# EAGLE design Camera Cage Breakout (EAGLE 9.6.2)

## Sheet 1 of 2: Connectors
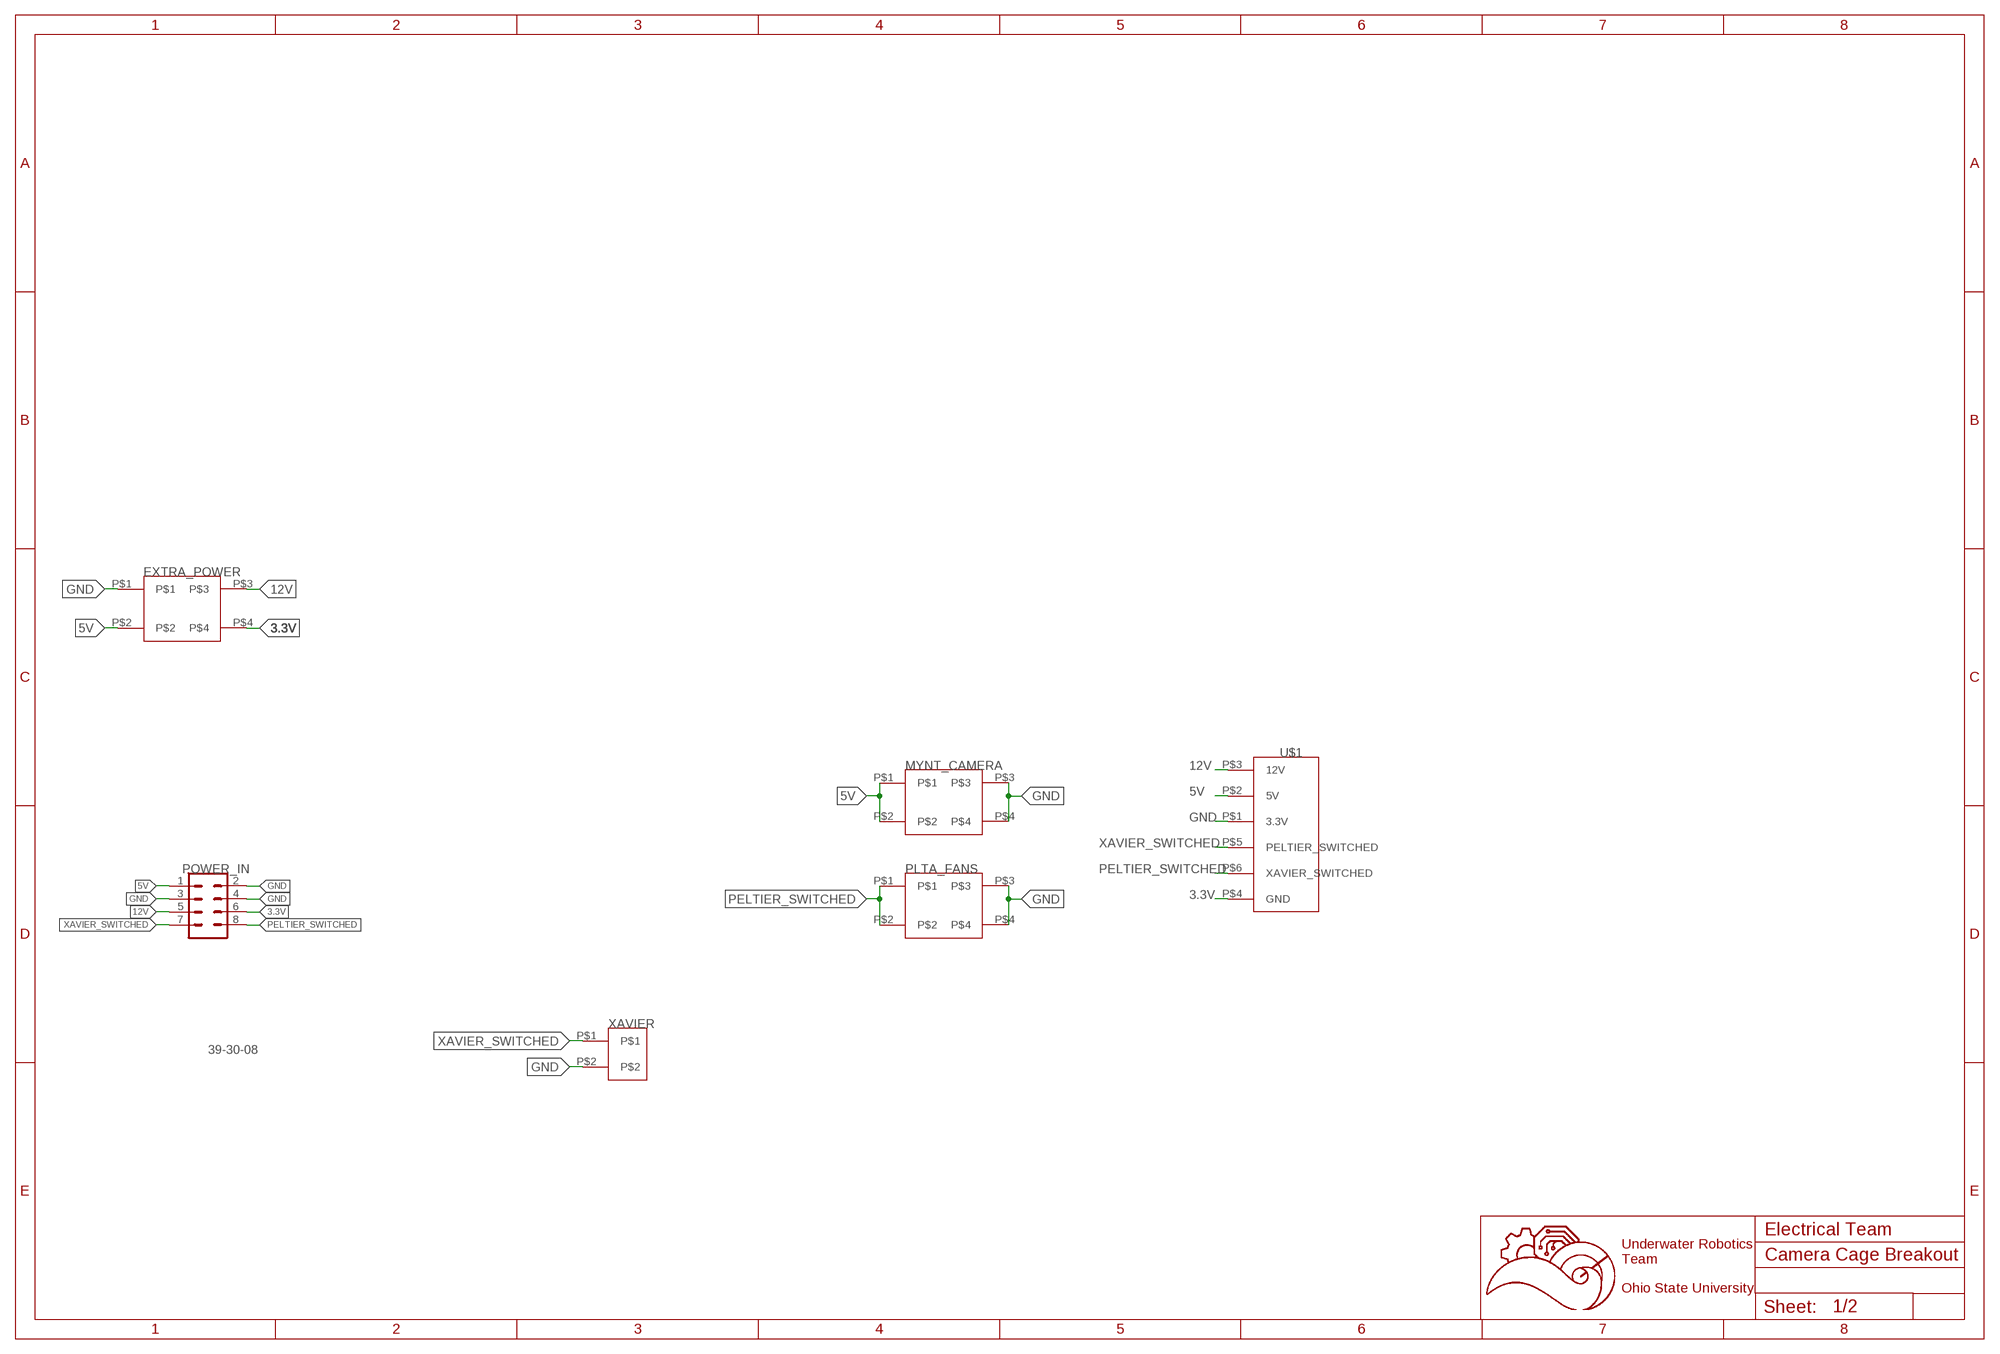
[diagram p0: schematic, sheet 1]

### Parts
EXTRA_POWER  4PIN-VERT  [4PIN-VERT]
MYNT_CAMERA  4PIN-VERT  [4PIN-VERT]
PLTA_FANS  4PIN-VERT  [4PIN-VERT]
POWER_IN  39-30-08  [39-30-?08?]
U$1  CAMERA_CAGE_TEST  [6-PIN]
XAVIER  2PIN-VERT  [2PIN-VERT]

### Nets
3.3V: EXTRA_POWER.P$4 POWER_IN.6 U$1.P$4(GND)
5V: EXTRA_POWER.P$2 MYNT_CAMERA.P$1 MYNT_CAMERA.P$2 POWER_IN.1 U$1.P$2(5V)
12V: EXTRA_POWER.P$3 POWER_IN.5 U$1.P$3(12V)
GND: EXTRA_POWER.P$1 MYNT_CAMERA.P$3 MYNT_CAMERA.P$4 PLTA_FANS.P$3 PLTA_FANS.P$4 POWER_IN.2 POWER_IN.3 POWER_IN.4 U$1.P$1(3.3V) XAVIER.P$2
PELTIER_SWITCHED: PLTA_FANS.P$1 PLTA_FANS.P$2 POWER_IN.8 U$1.P$6(XAVIER_SWITCHED)
XAVIER_SWITCHED: POWER_IN.7 U$1.P$5(PELTIER_SWITCHED) XAVIER.P$1

### Notes on the sheet
- Electrical Team
- Underwater Robotics
  Team
  
  Ohio State University

## Sheet 2 of 2: Led indicator
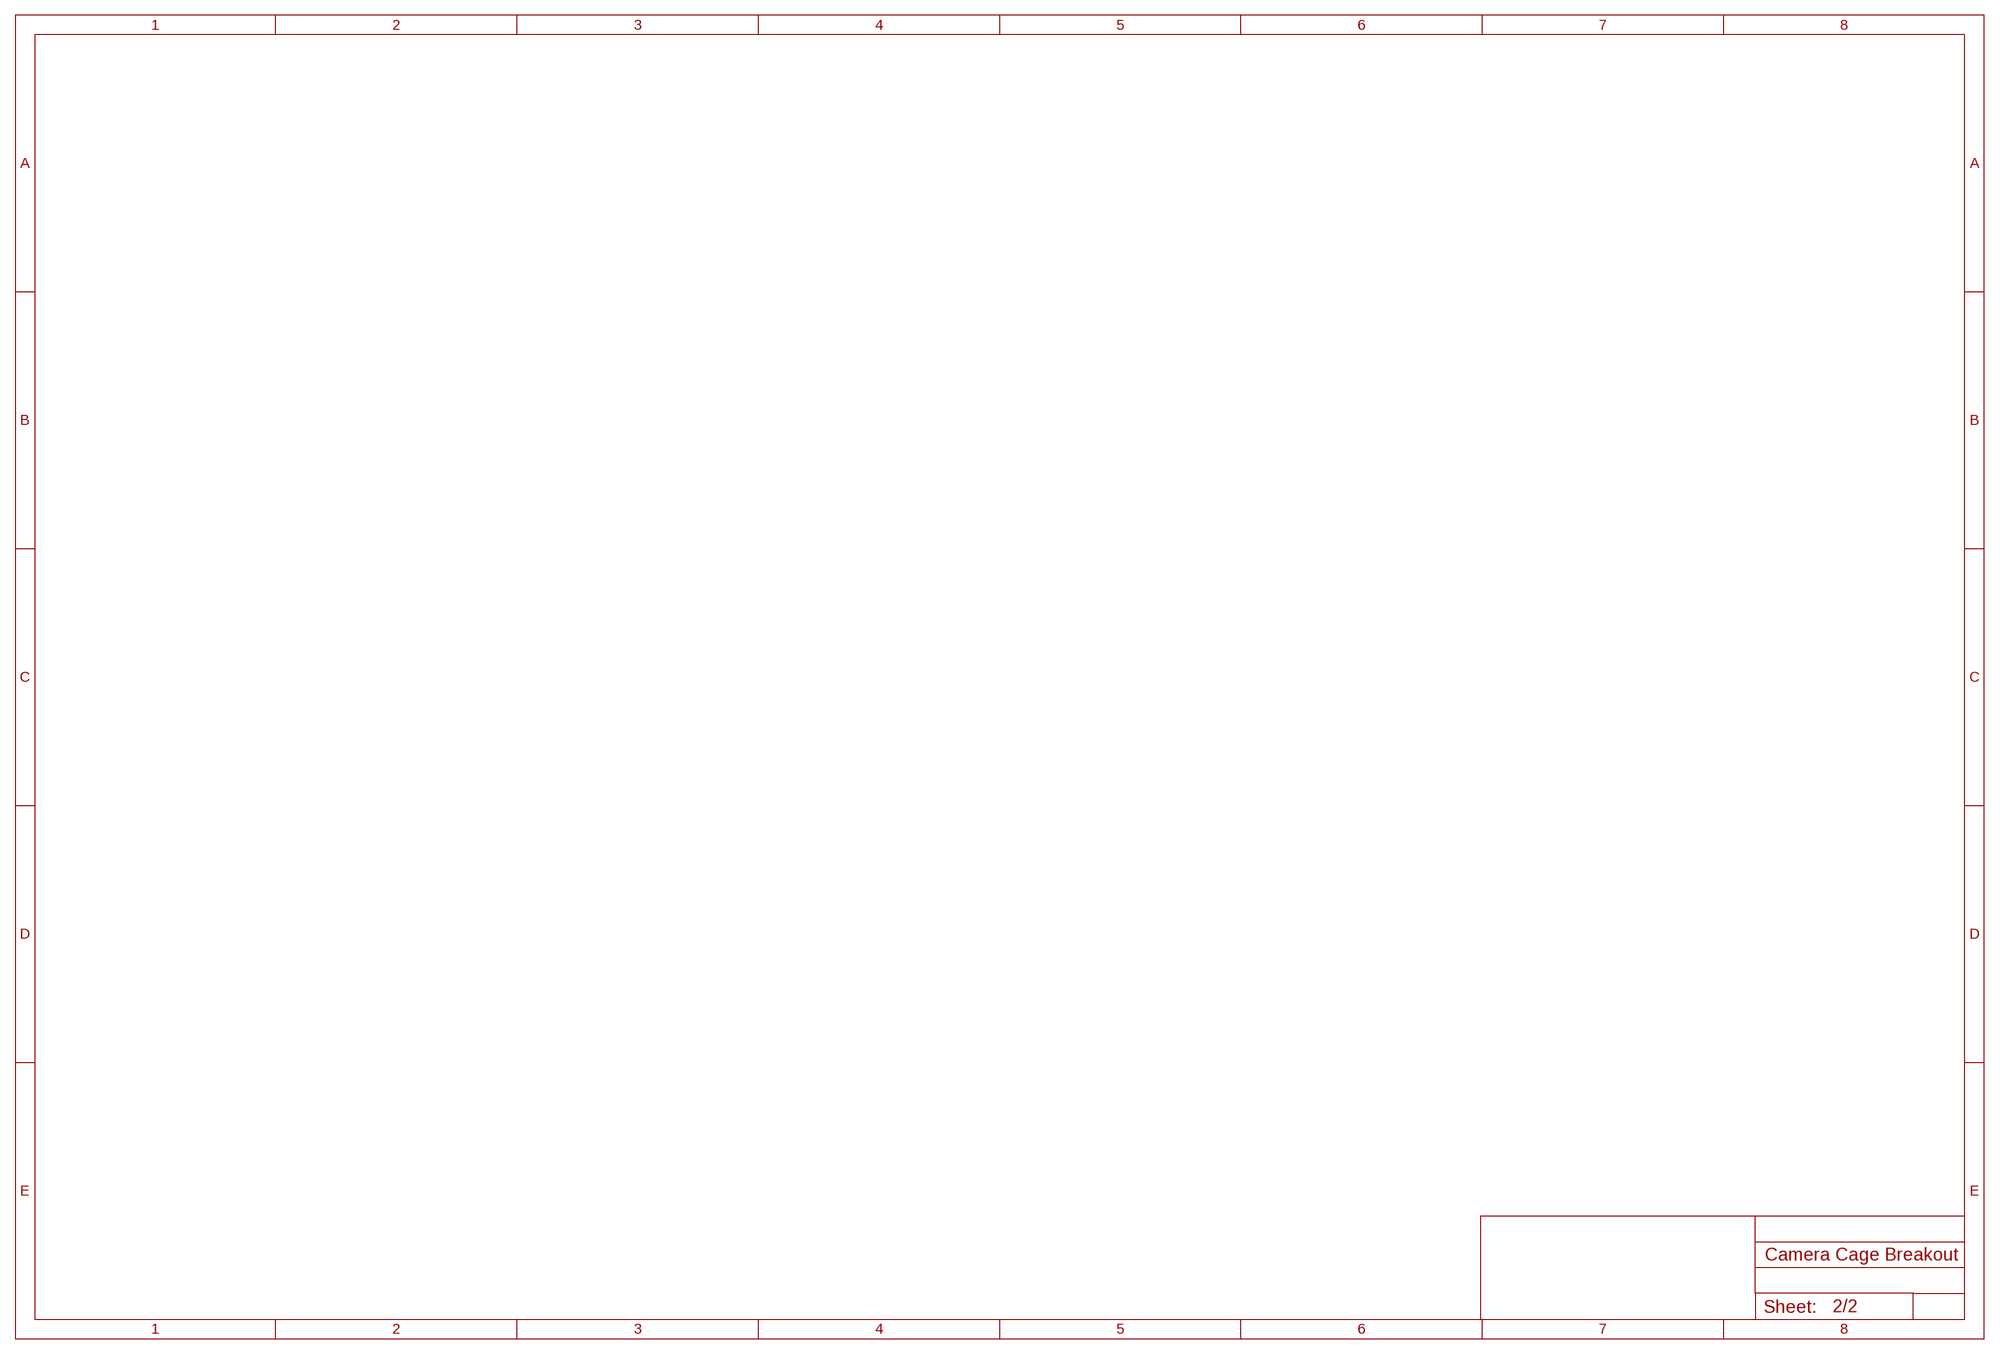
[diagram p1: schematic, sheet 2]

## Library data of the parts
EXTRA_POWER MYNT_CAMERA PLTA_FANS = Vertical_Connectors:4PIN-VERT
POWER_IN = con-molex-mini-fit:39-30-?08?: HEADER
U$1 = 3M_929852_Connector:CAMERA_CAGE_TEST
XAVIER = Vertical_Connectors:2PIN-VERT

## Board
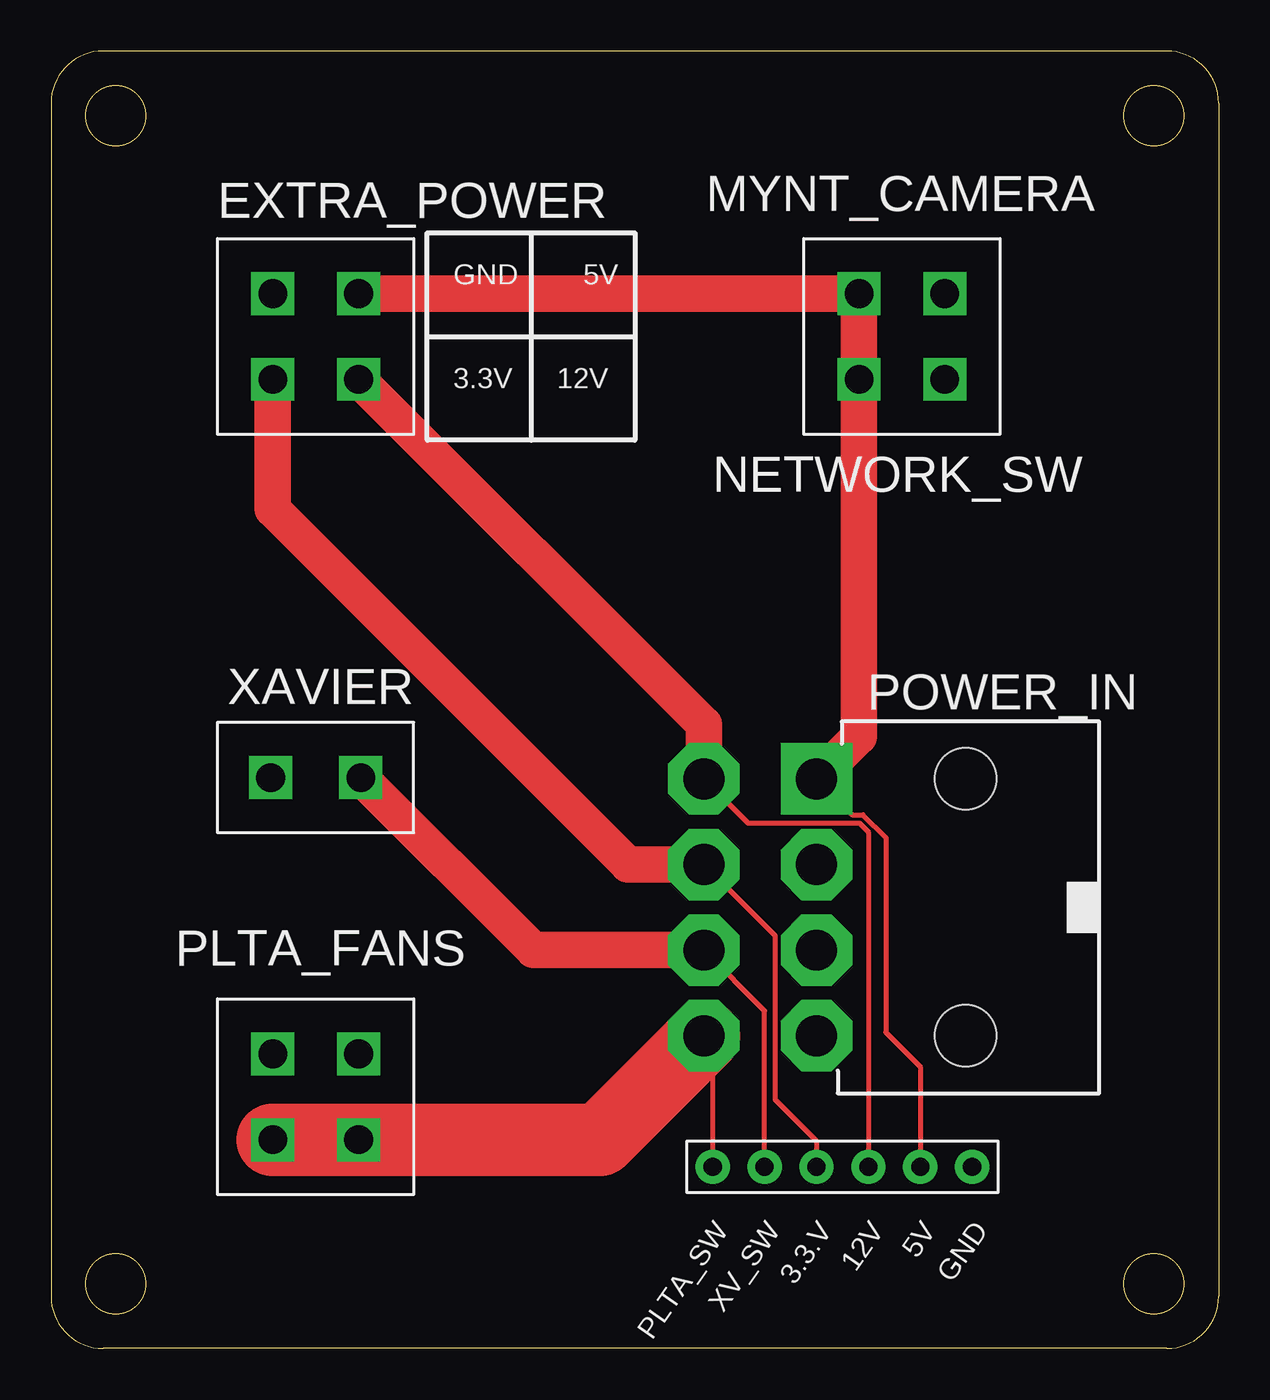
[diagram p2: board, top side]
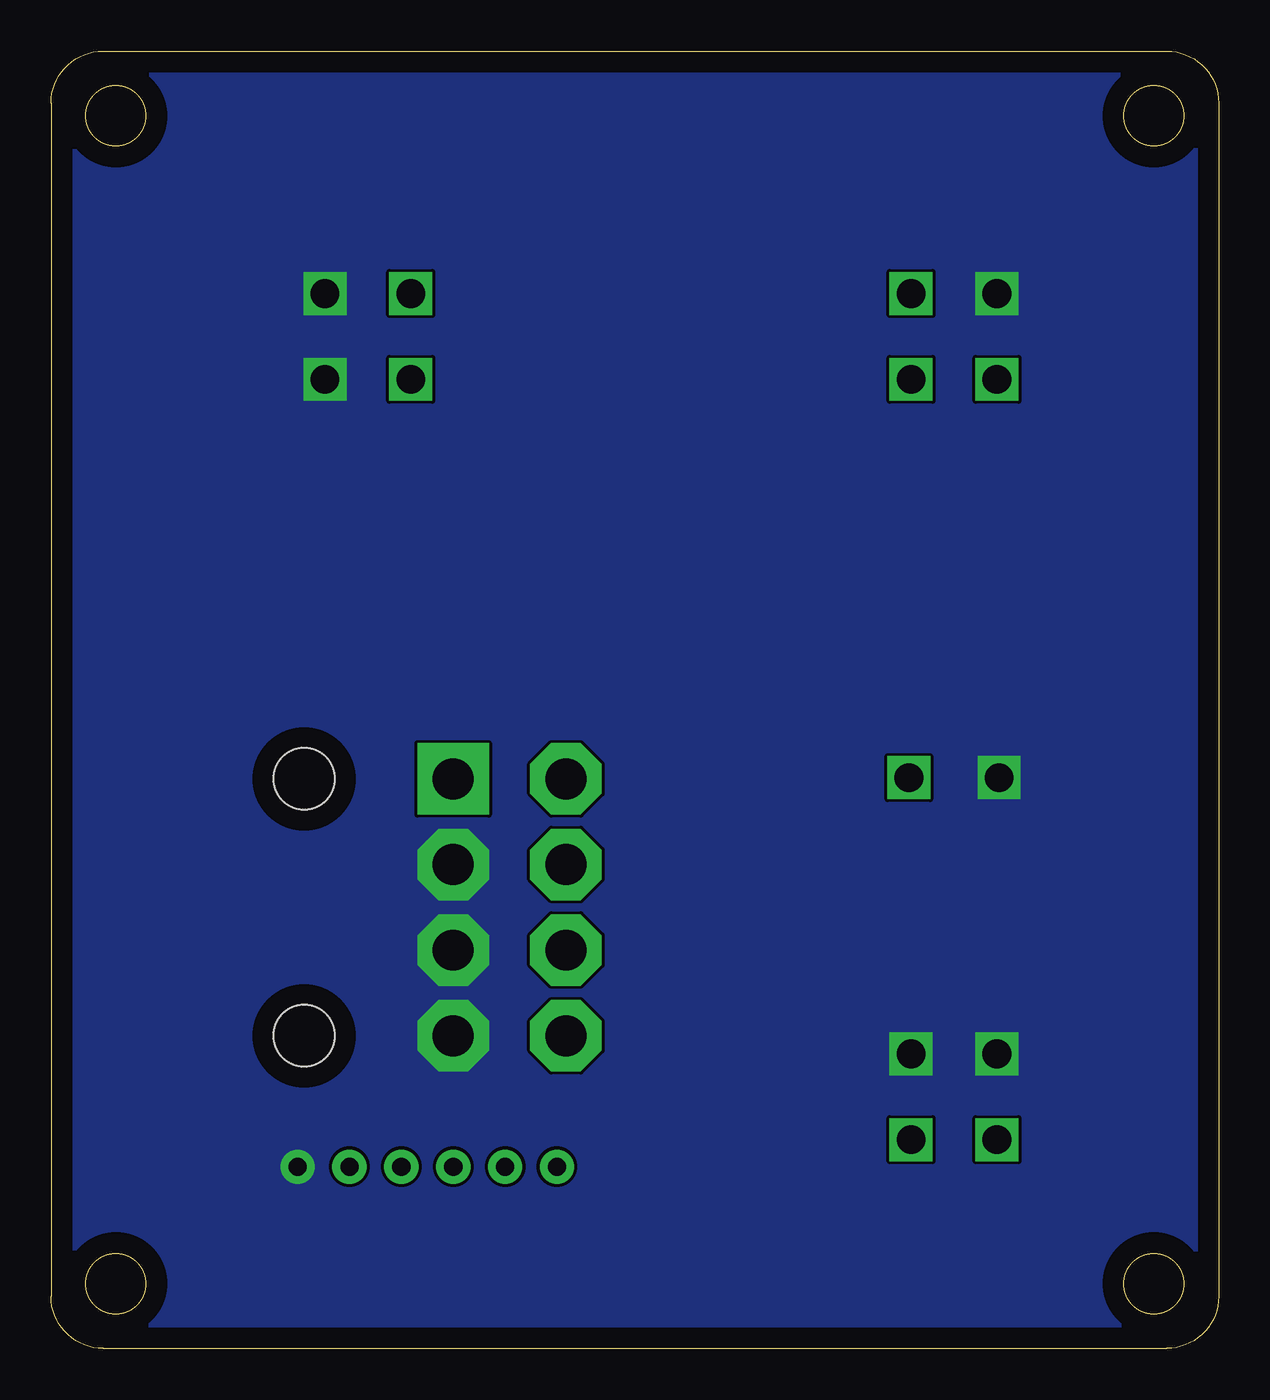
[diagram p3: board, bottom side, seen from below]

Size 57.15 x 63.5 mm. Coordinates in mm from the lower left corner, seen from the top.
Outline: 57.15,60.96 57.15,2.54 arc-90 54.61,0 2.54,0 arc-90 0,2.54 0,60.96 arc-90 2.54,63.5 54.61,63.5 arc-90 57.15,60.96
Outline: circle at 53.97,3.17 radius 1.47
Outline: circle at 3.18,3.17 radius 1.47
Outline: circle at 3.18,60.32 radius 1.47
Outline: circle at 53.97,60.32 radius 1.47
Copper layers (1*16): Top 0.035mm / dielectric 1.5mm / Bottom 0.035mm
Design rules "default": minimum track width 6mil, minimum drill 0.35mm, track to track 6mil, track to pad 6mil, pad to pad 6mil, via to via 6mil, smd to smd 6mil, copper to edge 40mil, drill to drill 6mil, minimum pad ring 10mil, minimum via ring 8mil, stop-mask expansion 4mil, vias tented up to drill 0mil, thermal gap 10mil

### Footprints (pad centres in the part's own frame; a part is rotated, then mirrored left to right if it is on the bottom)
4PIN-VERT = drill 1.4 square: P$1 -2.1,2.1; P$2 2.1,2.1; P$3 2.1,-2.1; P$4 -2.1,-2.1
39-30-?08? = drill 2 pad 3.5 square: 1 6.287,0 | drill 2 pad 3.5 octagon: 2 2.095,0; 3 -2.095,0; 4 -6.287,0; 5 6.287,5.512; 6 2.095,5.512; 7 -2.095,5.512; 8 -6.287,5.512 | hole 3: -6.287,-7.3; 6.287,-7.3
6-PIN = drill 0.889 pad 1.676: P$1 1.27,1.27; P$2 3.81,1.27; P$3 6.35,1.27; P$4 8.89,1.27; P$5 11.43,1.27; P$6 13.97,1.27
2PIN-VERT = drill 1.4 square: P$1 -2.207,0; P$2 2.207,0

### Placement (x,y rotation side)
EXTRA_POWER  12.95,49.53 0 top
MYNT_CAMERA  41.65,49.53 90 top
PLTA_FANS  12.95,12.32 180 top
POWER_IN  39-30-08?  [39-30-?08?]  37.46,21.59 90 top
U$1  46.35,10.16 180 top
XAVIER  12.95,27.94 180 top

### Tracks (layer width: path | path; a pad name or v marks a point on that pad's centre or on a via)
3.3V
  Top 0.254: POWER_IN.6 35.44,20.2 35.44,12.19 37.46,10.16 U$1.P$4
  Top 1.778: EXTRA_POWER.P$4 10.85,41.08 28.25,23.68 POWER_IN.6
5V
  Top 0.254: POWER_IN.1 39.22,26.12 39.74,26.12 40.85,25.01 40.85,15.48 42.55,13.79 U$1.P$2
  Top 1.778: EXTRA_POWER.P$2 MYNT_CAMERA.P$2 MYNT_CAMERA.P$1 39.55,29.96 POWER_IN.1
12V
  Top 0.254: POWER_IN.5 34.11,25.71 39.58,25.71 40,25.29 U$1.P$3
  Top 1.778: EXTRA_POWER.P$3 31.95,30.53 POWER_IN.5
GND
  pour Bottom (rank 2, no thermals): -0.09,64.04 -0.09,0 57.03,0 57.03,64.04
PELTIER_SWITCHED
  Top 0.254: 32.38,14.87 U$1.P$6
  Top 1.016: 32.38,14.87 POWER_IN.8
  Top 3.556: PLTA_FANS.P$2 PLTA_FANS.P$1 26.87,10.22 POWER_IN.8
XAVIER_SWITCHED
  Top 0.254: U$1.P$5 34.92,16.52 POWER_IN.7
  Top 1.778: POWER_IN.7 23.61,19.49 XAVIER.P$1

### Text on the board
tPlace: GND | 5V | 3.3V | 12V | NETWORK_SW | PLTA_SW | XV_SW | 3.3.V | 12V | 5V | GND